# EAGLE design odpojovac (EAGLE 7.7.0)
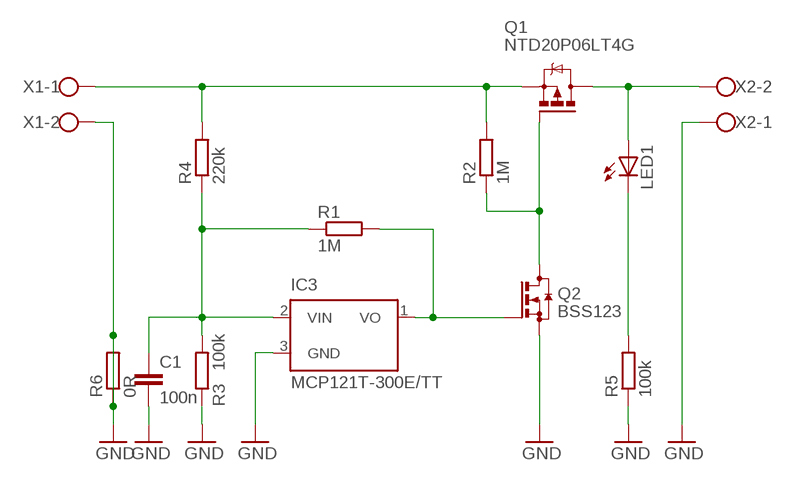
[diagram p0: schematic, sheet 1]

## Parts
C1  100n  C-EUC0805K  [C0805K]
IC3  MCP121T-300E/TT  MCP102  [SOT23]
LED1  LEDCHIPLED_0805  [CHIPLED_0805]
Q1  NTD20P06LT4G  IRFR5305  [D-PAK_TO252AA]
Q2  BSS123  [SOT23]
R1  1M  R-EU_R0805  [R0805]
R2  1M  R-EU_R0805  [R0805]
R3  100k  R-EU_R0805  [R0805]
R4  220k  R-EU_R0805  [R0805]
R5  100k  R-EU_R0805  [R0805]
R6  0R  R-EU_R1206  [R1206]
X1  W237-102  [W237-102]
X2  W237-102  [W237-102]

## Nets
GND: C1.2 IC3.3(GND) Q2.2(S) R3.1 R5.1 R6.1 R6.2 X1.2 X2.1
N$2: LED1.A Q1.4(D) X2.2
N$3: LED1.C R5.2
N$4: Q1.3(S) R2.2 R4.2 X1.1
N$5: IC3.1(VO) Q2.1(G) R1.2
N$7: C1.1 IC3.2(VIN) R1.1 R3.2 R4.1
N$8: Q1.1(G) Q2.3(D) R2.1

## Library data of the parts
C1 = rcl:C-EU: CAPACITOR, European symbol
IC3 = microchip:MCP102
LED1 = led:LED: LED OSRAM: - CHIPLED LG R971, LG N971, LY N971, LG Q971, LY Q971, LO R971, LY R971 LH N974, LH R974 LS Q976, LO Q976, LY Q976 LO Q996 - Hyper CHIPLED LW Q18S LB Q993, LB Q99A, LB R99A - SideLED LS A670, LO A670, LY A670, LG A670, LP A670 LB A673, LV A673, LT A673, LW A673 LH A674 LY A675 LS A676, LA A676, LO A676, LY A676, LW A676 LS A679, LY A679, LG A679 - Hyper Micro SIDELED® LS Y876, LA Y876, LO Y876, LY Y876 LT Y87S - SmartLED LW L88C, LW L88S LB L89C, LB L89S, LG L890 LS L89K, LO L89K, LY L89K LS L896, LA L896, LO L896, LY L896 - TOPLED LS T670, LO T670, LY T670, LG T670, LP T670 LSG T670, LSP T670, LSY T670, LOP T670, LYG T670 LG T671, LOG T671, LSG T671 LB T673, LV T673, LT T673, LW T673 LH T674 LS T676, LA T676, LO T676, LY T676, LB T676, LH T676, LSB T676, LW T676 LB T67C, LV T67C, LT T67C, LS T67K, LO T67K, LY T67K, LW E67C LS E67B, LA E67B, LO E67B, LY E67B, LB E67C, LV E67C, LT E67C LW T67C LS T679, LY T679, LG T679 LS T770, LO T770, LY T770, LG T770, LP T770 LB T773, LV T773, LT T773, LW T773 LH T774 LS E675, LA E675, LY E675, LS T675 LS T776, LA T776, LO T776, LY T776, LB T776 LHGB T686 LT T68C, LB T68C - Hyper Mini TOPLED® LB M676 - Mini TOPLED Santana® LG M470 LS M47K, LO M47K, LY M47K Source: http://www.osram.convergy.de LUXEON: - LUMILED® LXK2-PW12-R00, LXK2-PW12-S00, LXK2-PW14-U00, LXK2-PW14-V00 LXK2-PM12-R00, LXK2-PM12-S00, LXK2-PM14-U00 LXK2-PE12-Q00, LXK2-PE12-R00, LXK2-PE12-S00, LXK2-PE14-T00, LXK2-PE14-U00 LXK2-PB12-K00, LXK2-PB12-L00, LXK2-PB12-M00, LXK2-PB14-N00, LXK2-PB14-P00, LXK2-PB14-Q00 LXK2-PR12-L00, LXK2-PR12-M00, LXK2-PR14-Q00, LXK2-PR14-R00 LXK2-PD12-Q00, LXK2-PD12-R00, LXK2-PD12-S00 LXK2-PH12-R00, LXK2-PH12-S00 LXK2-PL12-P00, LXK2-PL12-Q00, LXK2-PL12-R00 Source: www.luxeon.com KINGBRIGHT: KA-3528ASYC Source: www.kingbright.com
Q1 = transistor-power:IRF?5305: HEXFET Power MOSFET Source: http://www.irf.com/product-info/datasheets/data/irfr5305pbf.pdf
Q2 = transistor-small-signal:BSS123: N-CHANNEL MOS FET
R1-R6 = rcl:R-EU_: RESISTOR, European symbol
X1 X2 = alpov2:W237-102: WAGO SCREW CLAMP

## Board
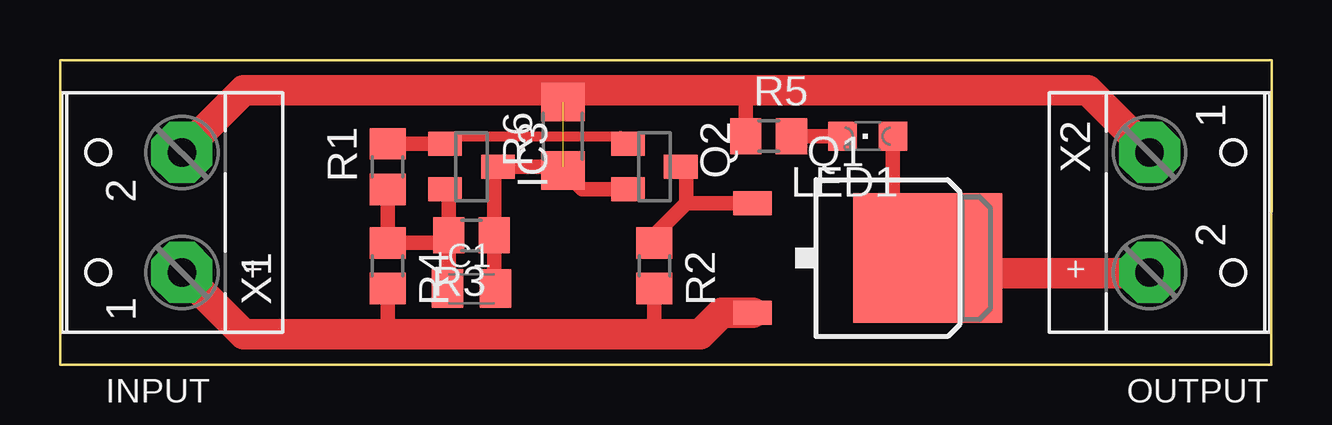
[diagram p1: board, top side]

Size 50.48 x 12.7 mm. Coordinates in mm from the lower left corner, seen from the top.
Outline: 0,0 50.46,0 50.48,12.7 0,12.7 0,0
Copper layers (1*16): Top 0.035mm / dielectric 1.5mm / Bottom 0.035mm
Design rules "default": minimum track width 10mil, minimum drill 24mil, track to track 8mil, track to pad 8mil, pad to pad 8mil, via to via 8mil, smd to smd 8mil, copper to edge 40mil, drill to drill 8mil, minimum pad ring 10mil, minimum via ring 8mil, stop-mask expansion 4mil, vias tented up to drill 0mil, thermal gap 10mil

### Footprints (pad centres in the part's own frame; a part is rotated, then mirrored left to right if it is on the bottom)
C0805K = smd 1.3 x 1.6: 1 -1,0; 2 1,0
SOT23 = smd 1 x 1.4: 1 -0.95,-1.1; 2 0.95,-1.1; 3 0,1.1
CHIPLED_0805 = smd 1.2 x 1.2: A 0,-1.05; C 0,1.05
D-PAK_TO252AA = smd 1 x 1.6: 1 -2.28,-4.8; 3 2.28,-4.8 | smd 5.4 x 6.2: 4 0,2.5
R0805 = smd 1.3 x 1.5: 1 -0.95,0; 2 0.95,0
R1206 = smd 1.6 x 1.803: 1 -1.422,0; 2 1.422,0
W237-102 = drill 1.194 pad 2.54 octagon: 1 -2.5,-1.27; 2 2.5,-1.27

### Placement (x,y rotation side)
C1  17.14,3.17 0 top
IC3  17.14,8.26 270 top
LED1  33.66,9.53 90 top
Q1  33.66,4.45 270 top
Q2  24.77,8.26 270 top
R1  13.65,8.26 90 top
R2  24.77,4.13 270 top
R3  17.14,5.4 180 top
R4  13.65,4.13 270 top
R5  29.53,9.53 0 top
R6  20.95,9.53 90 top
X1  3.81,6.35 90 top
X2  46.67,6.35 270 top

### Tracks (layer width: path | path; a pad name or v marks a point on that pad's centre or on a via)
GND  (1 unrouted)
  Top 0.61: C1.2 18.09,3.23 R3.1 18.09,8.11 IC3.3 20.95,8.26 R6.1 21.75,7.3 Q2.2 | R5.1 28.58,11.43 28.57,11.43 | R6.2 20.95,11.43
  Top 1.27: X1.2 7.66,11.43 20.95,11.43 28.57,11.43 42.82,11.43 X2.1
N$2
  Top 0.61: 35.98,4.62 Q1.4 34.7,5.89 LED1.A
  Top 1.27: Q1.4 36.79,3.81 45.36,3.81 X2.2
N$3
  Top 0.61: R5.2 LED1.C
N$4
  Top 0.61: R4.2 13.65,1.27 | R2.2 24.77,1.27
  Top 1.27: Q1.3 27.57,2.17 26.67,1.27 24.77,1.27 13.65,1.27 7.66,1.27 X1.1
N$5
  Top 0.406: 16.19,9.21 16.51,9.53 23.34,9.53 Q2.1
  Top 0.61: 16.19,9.21 IC3.1 R1.2
N$7
  Top 0.61: R3.2 16.2,7.16 IC3.2 | R3.2 16.2,3.23 C1.1 | R3.2 15.88,5.08 R4.1 R1.1
N$8
  Top 0.61: Q1.1 26.09,6.72 | 26.09,6.72 26.09,8.03 Q2.3 | R2.1 24.77,5.39 26.09,6.72

### Text on the board
tPlace: + | + | INPUT | OUTPUT